# Altium schematic sheet mdv_commutator(обоснование).SchDoc
size 410 x 297 mm; PageSetup: Record=PageOptions|CenterHorizontal=True|CenterVertical=True|PrintScale=1.00|XCorrection=1.00|YCorrection=1.00|PrintKind=1|BorderSize=5000000|LeftOffset=0|BottomOffset=0|Orientation=2|PaperLength=1000|PaperWidth=1000|Scale=100|PaperSource=15|PrintQuality=1200|MediaType=1|DitherType=10|PaperKind=A3|PrintScaleMode=1; Weight: -; ScaleFactor: -; NormInspection: Норм.Контр.
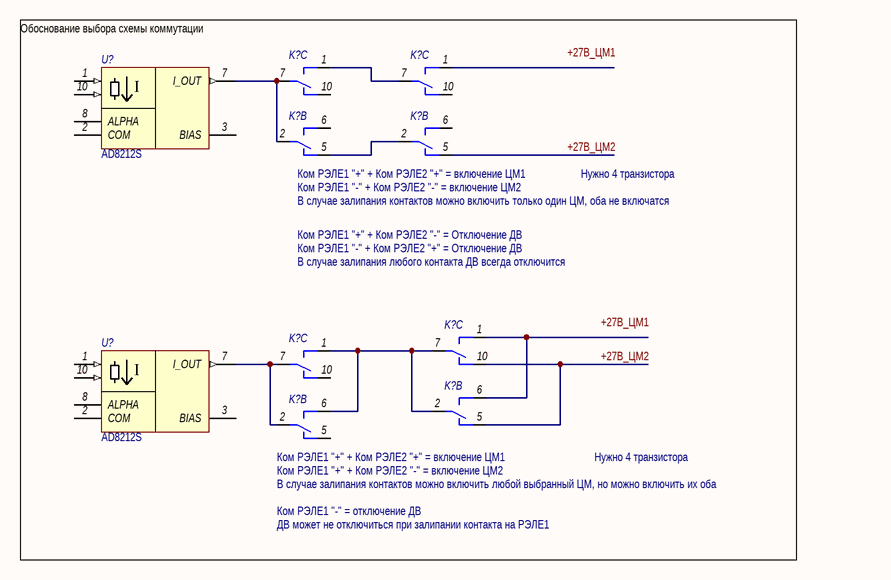
[diagram p0: mdv_commutator(обоснование).SchDoc]

## Parts
(Parts that share a designator on the sheet are numbered #1, #2 ... from top to bottom, then left to right.)
K?#1  RPS45-1-T-OS  [RPS-45-1]  (value not drawn)  (part C of 3)
K?#2  RPS45-1-T-OS  [RPS-45-1]  (value not drawn)  (part C of 3)
K?#3  RPS45-1-T-OS  [RPS-45-1]  (value not drawn)  (part B of 3)
K?#4  RPS45-1-T-OS  [RPS-45-1]  (value not drawn)  (part B of 3)
K?#5  RPS45-1-T-OS  [RPS-45-1]  (value not drawn)  (part C of 3)
K?#6  RPS45-1-T-OS  [RPS-45-1]  (value not drawn)  (part C of 3)
K?#7  RPS45-1-T-OS  [RPS-45-1]  (value not drawn)  (part B of 3)
K?#8  RPS45-1-T-OS  [RPS-45-1]  (value not drawn)  (part B of 3)
U?#1  AD8212S  [FlatPack-10_MSOP-8]
U?#2  AD8212S  [FlatPack-10_MSOP-8]

## Nets
+27В_ЦМ2: K?#4.5 K?#5.10 K?#7.5
NetK?#1_1: K?#1.1 K?#2.7
NetK?#1_7: K?#1.7 K?#3.2 U?#1.7(I_OUT)
NetK?#3_5: K?#3.5 K?#4.2
NetK?#5_1: K?#5.1 K?#7.6
NetK?#5_7: K?#5.7 K?#6.1 K?#7.2 K?#8.6
NetK?#6_7: K?#6.7 K?#8.2 U?#2.7(I_OUT)

Not connected (* = marked no-connect by the designer): K?#1 10; K?#2 1 10; K?#3 6; K?#4 6; K?#6 10; K?#8 5; U?#1 1(V+) 2(COM) 3(BIAS) 8(ALPHA) 10(V_SENSE); U?#2 1(V+) 2(COM) 3(BIAS) 8(ALPHA) 10(V_SENSE)

## Notes on the sheet
- (near K?#4) Ком РЭЛЕ1 "+" + Ком РЭЛЕ2 "+" = включение ЦМ1
- Нужно 4 транзистора
- (near K?#4) Ком РЭЛЕ1 "-" + Ком РЭЛЕ2 "-" = включение ЦМ2
- Ком РЭЛЕ1 "+" + Ком РЭЛЕ2 "-" = Отключение ДВ
- (near K?#4) В случае залипания контактов можно включить только один ЦМ, оба не включатся
- Ком РЭЛЕ1 "-" + Ком РЭЛЕ2 "+" = Отключение ДВ
- В случае залипания любого контакта ДВ всегда отключится
- (near K?#8) Ком РЭЛЕ1 "+" + Ком РЭЛЕ2 "+" = включение ЦМ1
- (near K?#8) Ком РЭЛЕ1 "+" + Ком РЭЛЕ2 "-" = включение ЦМ2
- Ком РЭЛЕ1 "-" = отключение ДВ
- (near K?#8) В случае залипания контактов можно включить любой выбранный ЦМ, но можно включить их оба
- Обоснование выбора схемы коммутации
- ДВ может не отключиться при залипании контакта на РЭЛЕ1
- Labels drawn without touching a wire or pin: +27В_ЦМ1
- Подп. и дата
- Инв. № дубл.
- Взам. инв. №
- Инв. № подл.
- Изм.
- Лист
- № докум.
- Подп.
- Дата
- Форма 2а ГОСТ 2.104-2006
- Копировал
- Формат А3
- (in symbol AD8212S) I

## Library data of the parts
K?#1-K?#8 = RPS45: Реле поляризованное; Потребление, Вт: 0,000; Наименование: РПС45-1-Т-ОС РС4.520.756-11; Назначение: Реле поляризованное; ComponentLink1Description: DataSheet; ComponentLink1URL: https://relays.ru/files/catalog/rps45.pdf
U?#1 U?#2 = AD8212S: Назначение: Токовый датчик; Наименование: AD8212S